# EasyEDA Pro project ProProject_ESP32-Gateway_2023-11-01.epro, schematic LED_Control_Board_Remote_1
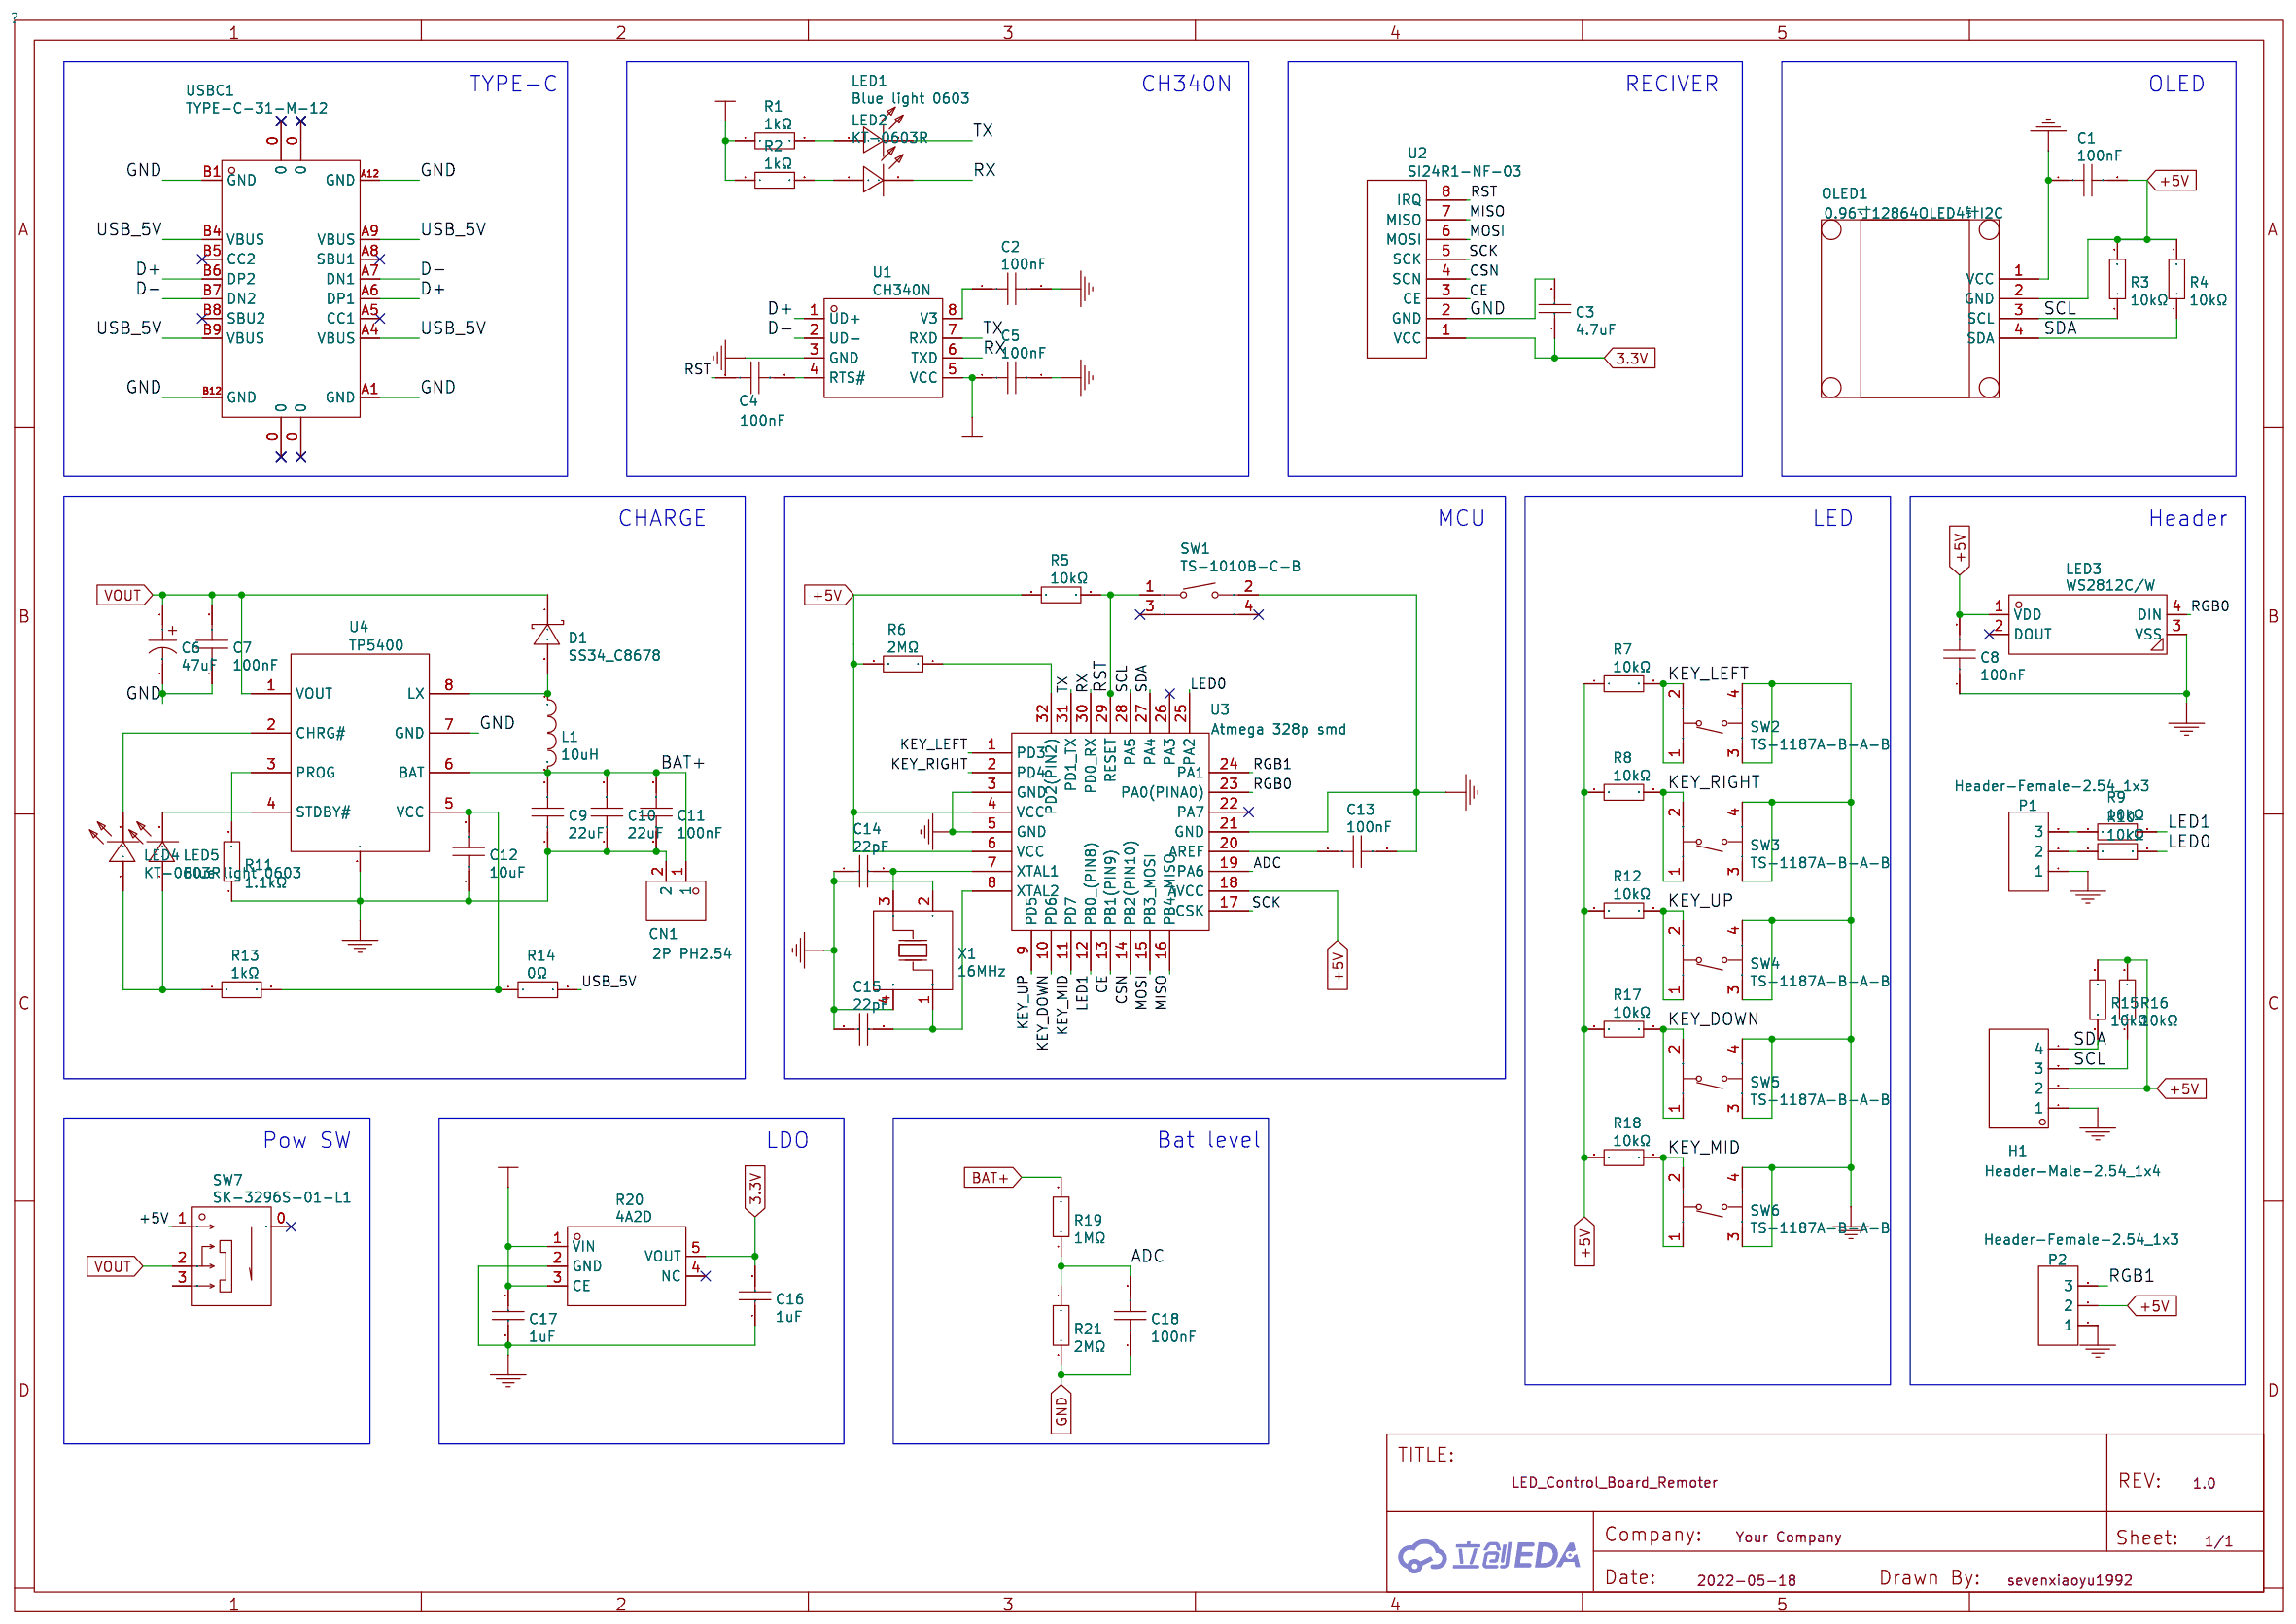
[diagram p1: schematic sheet]

## Parts
C1  100nF
C2  100nF
C3  4.7uF
C4  100nF
C5  100nF
C6  47uF
C7  100nF
C8  100nF
C9  22uF
C10  22uF
C11  100nF
C12  10uF
C13  100nF
C14  22pF
C15  22pF
C16  1uF
C17  1uF
C18  100nF
CN1  2P PH2.54
D1  SS34_C8678
H1  Header-Male-2.54_1x4
L1  10uH
LED1  Blue light 0603
LED2  KT-0603R
LED3  WS2812C/W
LED4  KT-0603R
LED5  Blue light 0603
OLED1  0.96寸12864OLED4针I2C
P1  Header-Female-2.54_1x3
P2  Header-Female-2.54_1x3
R1  1kΩ
R2  1kΩ
R3  10kΩ
R4  10kΩ
R5  10kΩ
R6  2MΩ
R7  10kΩ
R8  10kΩ
R9  10kΩ
R10  10kΩ
R11  1.1kΩ
R12  10kΩ
R13  1kΩ
R14  0Ω
R15  10kΩ
R16  10kΩ
R17  10kΩ
R18  10kΩ
R19  1MΩ
R20  4A2D
R21  2MΩ
SW1  TS-1010B-C-B
SW2  TS-1187A-B-A-B
SW3  TS-1187A-B-A-B
SW4  TS-1187A-B-A-B
SW5  TS-1187A-B-A-B
SW6  TS-1187A-B-A-B
SW7  SK-3296S-01-L1
U1  CH340N
U2  SI24R1-NF-03
U3  Atmega 328p smd
U4  TP5400
USBC1  TYPE-C-31-M-12
X1  16MHz

## Library data of the parts
C1 C2 C4 C5 C7 C8 C11 C13 C18 = CL10B104KB8NNNC: Supplier: LCSC; Manufacturer: SAMSUNG; Supplier Part: C1591; JLCPCB Part Class: Extended Part
C3 = CL10A475KO8NNNC: Supplier: LCSC; Manufacturer: SAMSUNG; Supplier Part: C19666; JLCPCB Part Class: Basic Part
C6 = CA45A-B-16V-47UF-M: Supplier: LCSC; Supplier Part: C2976930; Manufacturer: CEC(振华新云); JLCPCB Part Class: Extended Part
C9 C10 = CL10A226MQ8NRNC: Supplier: LCSC; Manufacturer: SAMSUNG; Supplier Part: C59461; JLCPCB Part Class: Basic Part
C12 = CL10A106KP8NNNC: Supplier: LCSC; Manufacturer: SAMSUNG; Supplier Part: C19702; JLCPCB Part Class: Basic Part
C14 C15 = CL10C220JB8NNNC: Supplier: LCSC; Manufacturer: SAMSUNG; Supplier Part: C1653; JLCPCB Part Class: Basic Part
C16 C17 = CL10A105KB8NNNC: Supplier: LCSC; Manufacturer: SAMSUNG; Supplier Part: C15849; JLCPCB Part Class: Basic Part
CN1 = 2P PH2.54: Supplier: LCSC; Supplier Part: C9900006197; JLCPCB Part Class: Extended Part
D1 = SS34: Supplier: LCSC; Manufacturer: MDD; Supplier Part: C8678; JLCPCB Part Class: Basic Part
H1 = 210S-1*4P L=11.6MMGold-plated black: Supplier: LCSC; Manufacturer: Ckmtw; Supplier Part: C124378; JLCPCB Part Class: Extended Part
L1 = SLO0420H100MTT: Supplier: LCSC; Supplier Part: C207832; Manufacturer: Sunltech Tech; JLCPCB Part Class: Extended Part
LED1 LED5 = Blue light 0603: Supplier: LCSC; Manufacturer: KENTO; Supplier Part: C2288; JLCPCB Part Class: Extended Part
LED2 LED4 = KT-0603R: Supplier: LCSC; Manufacturer: KENTO; Supplier Part: C2286; JLCPCB Part Class: Basic Part
LED3 = WS2812C/W: Supplier: LCSC; Supplier Part: C2761796; Manufacturer: worldsemi; JLCPCB Part Class: Extended Part
OLED1 = 0.96寸12864OLED4针I2C
P1 P2 = Header-Female-2.54_1x3: Supplier Part: C146243; Supplier: LCSC; Manufacturer: Boom Precision Elec; link: https://datasheet.lcsc.com/szlcsc/Boom-Precision-Elec-2-54mm-1-8P-Straight-Female-header_C27438.pdf; JLCPCB Part Class: Extended Part
R1 R2 R13 = 0603WAF1001T5E: Supplier: LCSC; Manufacturer: UniOhm; Supplier Part: C21190; Resistance: 1K; JLCPCB Part Class: Basic Part
R3-R5 R7-R10 R12 R15-R18 = 0603WAF1002T5E: Supplier: LCSC; Manufacturer: UniOhm; Supplier Part: C25804; Resistance: 10K; JLCPCB Part Class: Basic Part
R6 R21 = 0603WAF2004T5E: Supplier: LCSC; Manufacturer: UniOhm; Supplier Part: C22976; Resistance: 2M; JLCPCB Part Class: Basic Part
R11 = 0603WAF1101T5E: Supplier: LCSC; Manufacturer: UniOhm; Supplier Part: C22764; Resistance: 1.1K; JLCPCB Part Class: Basic Part
R14 = 0603WAF0000T5E: Supplier: LCSC; Manufacturer: UniOhm; Supplier Part: C21189; Resistance: 0; JLCPCB Part Class: Basic Part
R19 = 0603WAF1004T5E: Supplier: LCSC; Manufacturer: UniOhm; Supplier Part: C22935; Resistance: 1M; JLCPCB Part Class: Basic Part
R20 = 4A2D: Supplier: LCSC; Supplier Part: C2832127; Manufacturer: FM富满; JLCPCB Part Class: Extended Part
SW1 = TS-1010B-C-B: Supplier: LCSC; Supplier Part: C318940; Manufacturer: XKB Enterprise
SW2-SW6 = TS-1187A-B-A-B: Supplier: LCSC; Supplier Part: C318884; Manufacturer: XKB Enterprise; JLCPCB Part Class: Basic Part
SW7 = SK-3296S-01-L1: Supplier: LCSC; Supplier Part: C319020; Manufacturer: XKB Enterprise; JLCPCB Part Class: Extended Part
U1 = CH340N: Supplier: LCSC; Supplier Part: C506813; Manufacturer: WCH(Jiangsu Qin Heng); JLCPCB Part Class: Extended Part
U2 = SI24R1-NF-03
U3 = Atmega 328p smd: Mounted: Yes; Supplier Part: undefined; Supplier: EasyEDA
U4 = TP5400: Supplier: LCSC; Manufacturer: TOPPOWER; Supplier Part: C24154; JLCPCB Part Class: Extended Part
USBC1 = TYPE-C-31-M-12: Supplier: LCSC; Supplier Part: C165948; Manufacturer: Rectangular Connectors - Contacts; JLCPCB Part Class: Extended Part
X1 = X322516MLB4SI: Supplier: LCSC; Manufacturer: YXC; Supplier Part: C13738; JLCPCB Part Class: Basic Part

## Nets
3.3V: C3.1 C16.2 R20.5(VOUT) U2.1(VCC)
+5V: C1.2 C5.1 C8.2 C17.2 H1.2 LED3.1(VDD) OLED1.2(GND) P2.2 R1.1 R2.1 R3.2 R4.2 R5.1 R6.2 R7.1 R8.1 R12.1 R15.2 R16.2 R17.1 R18.1 R20.1(VIN) R20.3(CE) SW7.1 U1.5(VCC) U3.4(VCC) U3.6(VCC) U3.18(AVCC)
GND: C1.1 C2.2 C3.2 C5.2 C6.2 C7.1 C8.1 C9.1 C10.1 C11.1 C12.1 C13.2 C14.1 C15.1 C16.1 C17.1 C18.1 CN1.2 H1.1 LED3.3(VSS) OLED1.1(VCC) P1.1 P2.1 R11.1 R20.2(GND) R21.1 SW1.2 SW2.3(C) SW2.4(D) SW3.3(C) SW3.4(D) SW4.3(C) SW4.4(D) SW5.3(C) SW5.4(D) SW6.3(C) SW6.4(D) U1.3(GND) U2.2(GND) U3.3(GND) U3.5(GND) U3.21(GND) U4.7(GND) U4.9 USBC1.A1(GND) USBC1.A12(GND) USBC1.B1(GND) USBC1.B12(GND) X1.2(GND) X1.4(GND)
ADC: C18.2 R19.1 R21.2 U3.19(PA6)
BAT+: C9.2 C10.2 C11.2 CN1.1 L1.2 R19.2 U4.6(BAT)
CE: U2.3(CE) U3.13(PB1(PIN9))
CSN: U2.4(SCN) U3.14(PB2(PIN10))
D+: U1.1(UD+) USBC1.A6(DP1) USBC1.B6(DP2)
D-: U1.2(UD-) USBC1.A7(DN1) USBC1.B7(DN2)
KEY_DOWN: R17.2 SW5.1(A) SW5.2(B) U3.10(PD6)
KEY_LEFT: R7.2 SW2.1(A) SW2.2(B) U3.1(PD3)
KEY_MID: R18.2 SW6.1(A) SW6.2(B) U3.11(PD7)
KEY_RIGHT: R8.2 SW3.1(A) SW3.2(B) U3.2(PD4)
KEY_UP: R12.2 SW4.1(A) SW4.2(B) U3.9(PD5)
LED0: R10.2 U3.25(PA2)
LED1: R9.2 U3.12(PB0 (PIN8))
MISO: U2.7(MISO) U3.16(PB4 MISO)
MOSI: U2.6(MOSI) U3.15(PB3 MOSI)
RGB0: LED3.4(DIN) U3.23(PA0(PINA0))
RGB1: P2.3 U3.24(PA1)
RST: C4.1 R5.2 SW1.1 U2.8(IRQ) U3.29(RESET)
RX: LED2.2(K) U1.6(TXD) U3.30(PD0 RX)
SCK: U2.5(SCK) U3.17(CSK)
SCL: H1.3 OLED1.3(SCL) R3.1 R16.1 U3.28(PA5)
SDA: H1.4 OLED1.4(SDA) R4.1 R15.1 U3.27(PA4)
TX: LED1.2(K) U1.7(RXD) U3.31(PD1 TX)
USB_5V: R14.2 USBC1.A4(VBUS) USBC1.A9(VBUS) USBC1.B4(VBUS) USBC1.B9(VBUS)
VOUT: C6.1 C7.2 D1.1(K) SW7.2 U4.1(VOUT)
Net-(C2-1): C2.1 U1.8(V3)
Net-(C4-2): C4.2 U1.4(RTS#)
Net-(C12-2): C12.2 R13.2 R14.1 U4.5(VCC)
Net-(C13-1): C13.1 U3.20(AREF)
Net-(C14-2): C14.2 U3.7(XTAL1) X1.3(OSC2)
Net-(C15-2): C15.2 U3.8(XTAL2) X1.1(OSC1)
Net-(D1-2): D1.2(A) L1.1 U4.8(LX)
Net-(LED1-1): LED1.1(A) R1.2
Net-(LED2-1): LED2.1(A) R2.2
Net-(LED4-1): LED4.1(A) LED5.1(A) R13.1
Net-(LED4-2): LED4.2(K) U4.2(CHRG#)
Net-(LED5-2): LED5.2(K) U4.4(STDBY#)
Net-(P1-2): P1.2 R10.1
Net-(P1-3): P1.3 R9.1
Net-(R6-1): R6.1 U3.32(PD2(PIN2))
Net-(R11-2): R11.2 U4.3(PROG)

Not connected (* = marked no-connect by the designer): LED3 2(DOUT)*; R20 4(NC)*; SW1 3* 4*; SW7 0* 3; U3 22(PA7)* 26(PA3)*; USBC1 0* A5(CC1)* A8(SBU1)* B5(CC2)* B8(SBU2)*

## Notes on the sheet
- TYPE-C
- CH340N
- RECIVER
- OLED
- CHARGE
- MCU
- LED
- Header
- Pow SW
- LDO
- Bat level
